# Altium schematic sheet I2C_CH1.SchDoc
size A3; ApprovedBy: D. Grossman; CheckedBy: G. Engel; Author: Y. Yakov; CompanyName: LightSense; DrawnBy: Y. Yakov; Engineer: Y.Yakov; Organization: LightSense
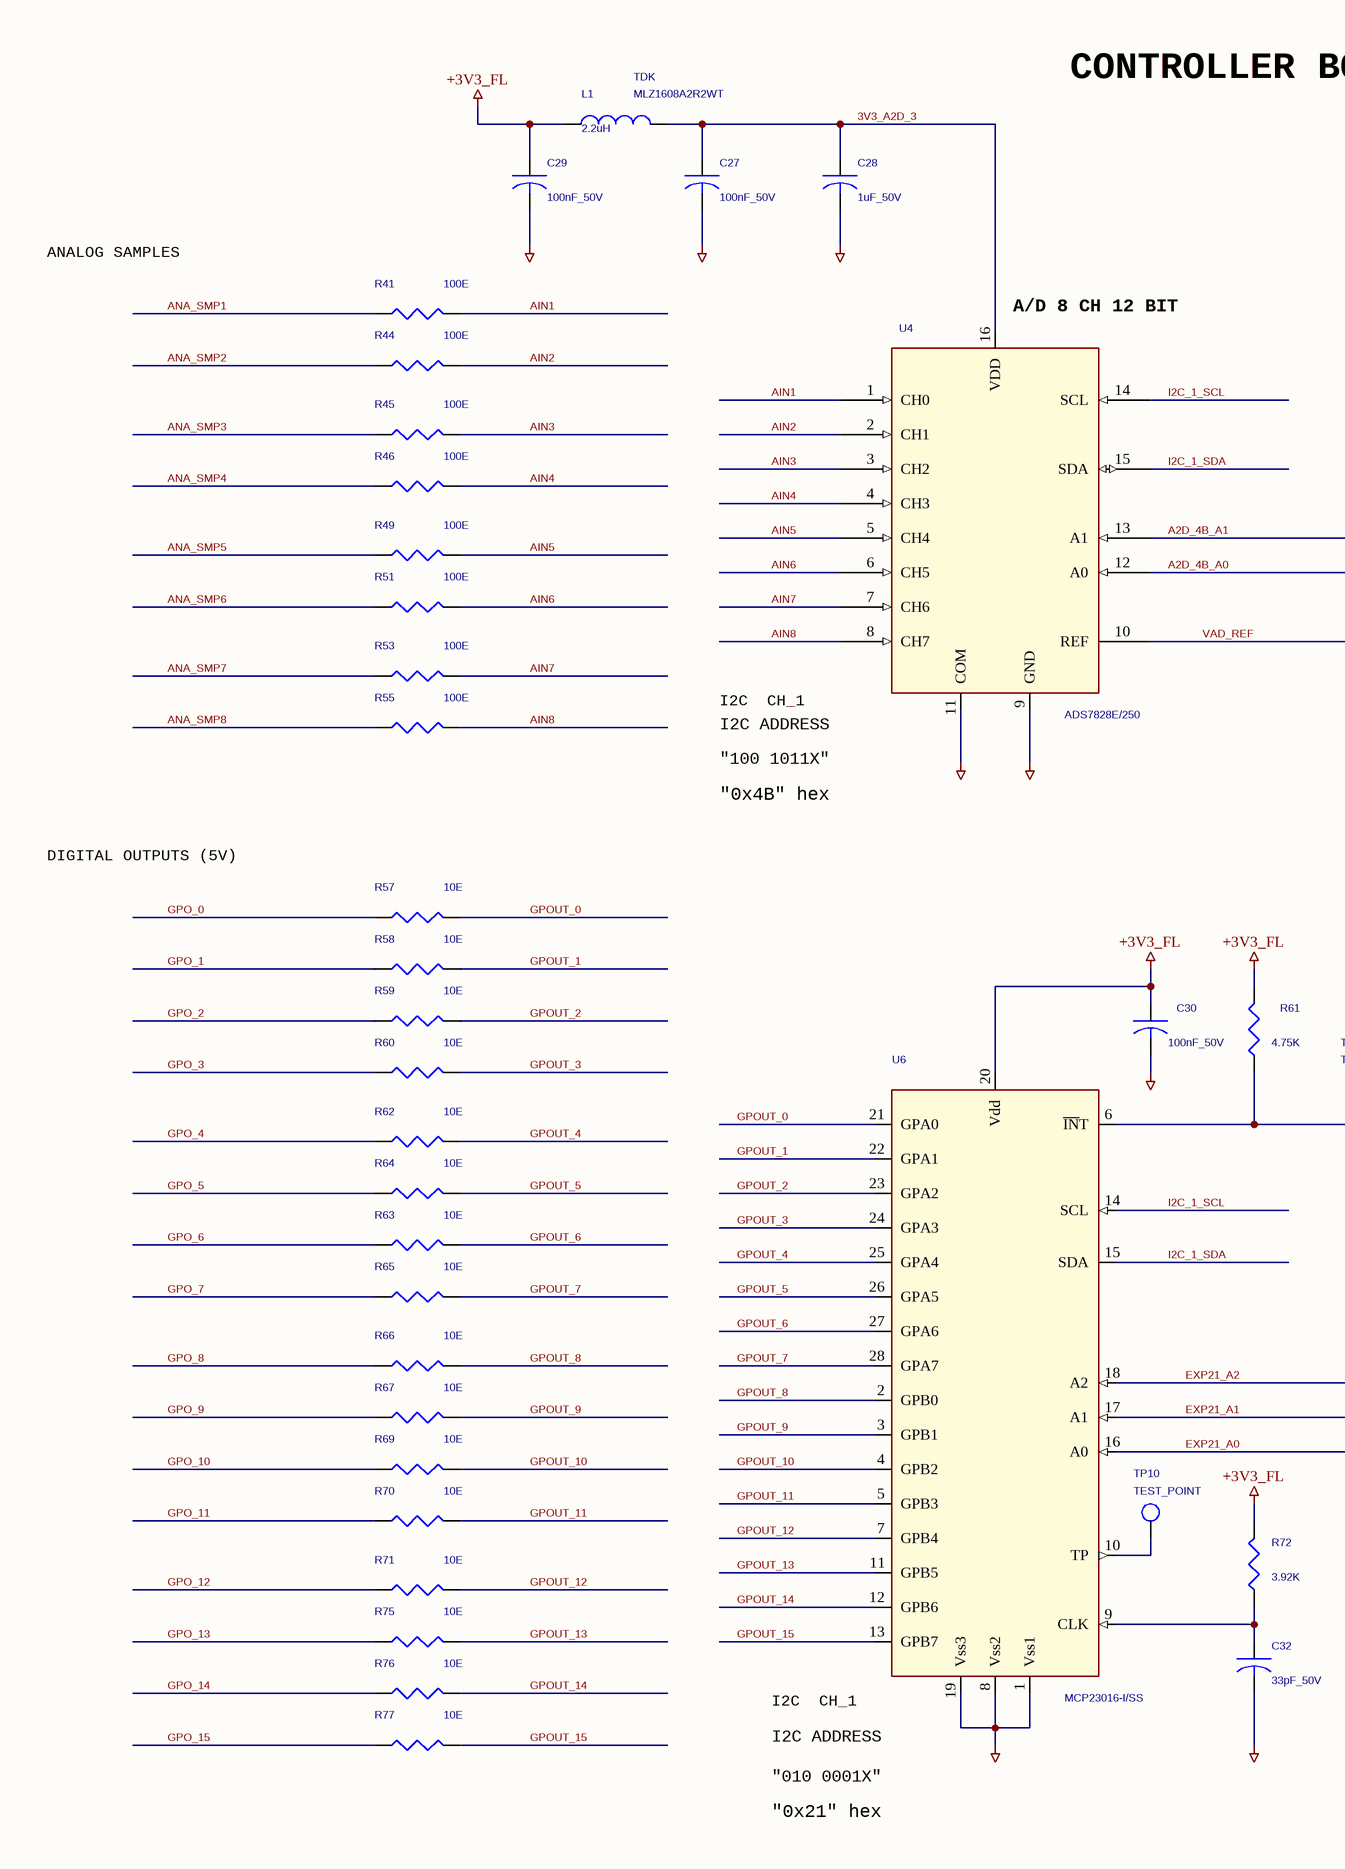
[diagram p0: I2C_CH1.SchDoc, left]
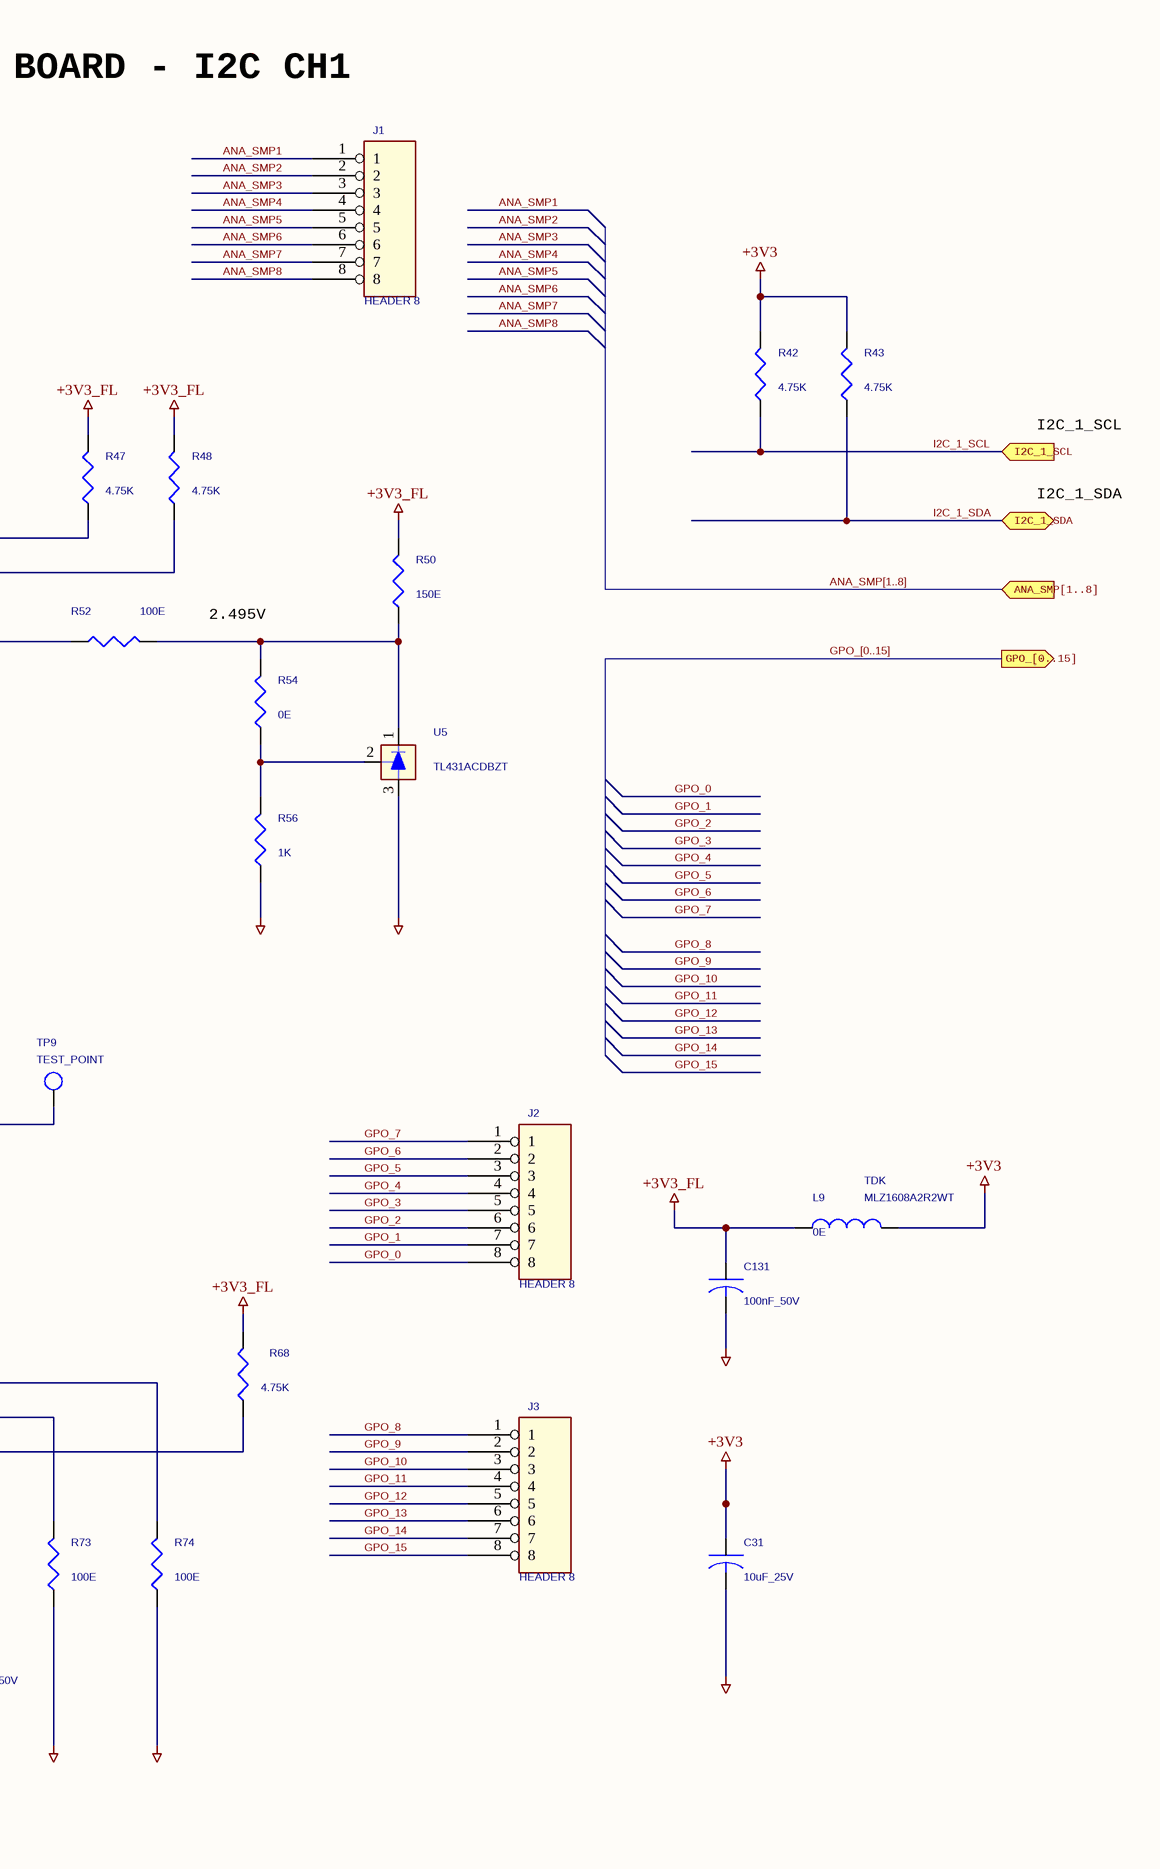
[diagram p1: I2C_CH1.SchDoc, right]

## Parts
C27  100nF_50V  [0603]
C28  1uF_50V  [0805]
C29  100nF_50V  [0603]
C30  100nF_50V  [0603]
C31  10uF_25V  [1206]
C32  33pF_50V  [0603]
C131  100nF_50V  [0603]
J1  HEADER 8  [TH_8PIN_100mil]
J2  HEADER 8  [TH_8PIN_100mil]
J3  HEADER 8  [TH_8PIN_100mil]
L1  2.2uH  MFG_PN: MLZ1608A2R2WT  MFG: TDK  [0603]
L9  0E  MFG: TDK  MFG_PN: MLZ1608A2R2WT  [0603]
R41  100E  [0603]
R42  4.75K  [0603]
R43  4.75K  [0603]
R44  100E  [0603]
R45  100E  [0603]
R46  100E  [0603]
R47  4.75K  [0603]
R48  4.75K  [0603]
R49  100E  [0603]
R50  150E  [0603]
R51  100E  [0603]
R52  100E  [0603]
R53  100E  [0603]
R54  0E  [0603]
R55  100E  [0603]
R56  1K  [0603]
R57  10E  [0603]
R58  10E  [0603]
R59  10E  [0603]
R60  10E  [0603]
R61  4.75K  [0603]
R62  10E  [0603]
R63  10E  [0603]
R64  10E  [0603]
R65  10E  [0603]
R66  10E  [0603]
R67  10E  [0603]
R68  4.75K  [0603]
R69  10E  [0603]
R70  10E  [0603]
R71  10E  [0603]
R72  3.92K  [0603]
R73  100E  [0603]
R74  100E  [0603]
R75  10E  [0603]
R76  10E  [0603]
R77  10E  [0603]
TP9  TEST_POINT  [TH_1mm]
TP10  TEST_POINT  [TH_1mm]
U4  ADS7828E/250  [TSSOP_16]
U5  TL431ACDBZT  [SOT_23]
U6  MCP23016-I/SS  [SSOP_28]

## Ports
ANA_SMP[1..8] (in), GPO_[0..15] (out), I2C_1_SCL (in), I2C_1_SDA (bidir)

## Nets
+3V3: C31.1 L9.2 R42.2 R43.2
+3V3_FL: C29.1 C30.1 C131.1 L1.1 L9.1 R47.2 R48.2 R50.2 R61.2 R68.2 R72.2 U6.20(Vdd)
GND_CPU: C27.2 C28.2 C29.2 C30.2 C31.2 C32.2 C131.2 R56.1 R73.1 R74.1 U4.9(GND) U4.11(COM) U5.3(ANODA) U6.1(Vss1) U6.8(Vss2) U6.19(Vss3)
3V3_A2D_3: C27.1 C28.1 L1.2 U4.16(VDD)
A2D_4B_A0: R48.1 U4.12(A0)
A2D_4B_A1: R47.1 U4.13(A1)
AIN1: R41.1 U4.1(CH0)
AIN2: R44.1 U4.2(CH1)
AIN3: R45.1 U4.3(CH2)
AIN4: R46.1 U4.4(CH3)
AIN5: R49.1 U4.5(CH4)
AIN6: R51.1 U4.6(CH5)
AIN7: R53.1 U4.7(CH6)
AIN8: R55.1 U4.8(CH7)
ANA_SMP1: J1.1 R41.2
ANA_SMP2: J1.2 R44.2
ANA_SMP3: J1.3 R45.2
ANA_SMP4: J1.4 R46.2
ANA_SMP5: J1.5 R49.2
ANA_SMP6: J1.6 R51.2
ANA_SMP7: J1.7 R53.2
ANA_SMP8: J1.8 R55.2
EXP21_A0: R68.1 U6.16(A0)
EXP21_A1: R73.2 U6.17(A1)
EXP21_A2: R74.2 U6.18(A2)
GPO_0: J2.8 R57.2
GPO_1: J2.7 R58.2
GPO_2: J2.6 R59.2
GPO_3: J2.5 R60.2
GPO_4: J2.4 R62.2
GPO_5: J2.3 R64.2
GPO_6: J2.2 R63.2
GPO_7: J2.1 R65.2
GPO_8: J3.1 R66.2
GPO_9: J3.2 R67.2
GPO_10: J3.3 R69.2
GPO_11: J3.4 R70.2
GPO_12: J3.5 R71.2
GPO_13: J3.6 R75.2
GPO_14: J3.7 R76.2
GPO_15: J3.8 R77.2
GPOUT_0: R57.1 U6.21(GPA0)
GPOUT_1: R58.1 U6.22(GPA1)
GPOUT_2: R59.1 U6.23(GPA2)
GPOUT_3: R60.1 U6.24(GPA3)
GPOUT_4: R62.1 U6.25(GPA4)
GPOUT_5: R64.1 U6.26(GPA5)
GPOUT_6: R63.1 U6.27(GPA6)
GPOUT_7: R65.1 U6.28(GPA7)
GPOUT_8: R66.1 U6.2(GPB0)
GPOUT_9: R67.1 U6.3(GPB1)
GPOUT_10: R69.1 U6.4(GPB2)
GPOUT_11: R70.1 U6.5(GPB3)
GPOUT_12: R71.1 U6.7(GPB4)
GPOUT_13: R75.1 U6.11(GPB5)
GPOUT_14: R76.1 U6.12(GPB6)
GPOUT_15: R77.1 U6.13(GPB7)
I2C_1_SCL: R42.1 U4.14(SCL) U6.14(SCL) ; port I2C_1_SCL
I2C_1_SDA: R43.1 U4.15(SDA) U6.15(SDA) ; port I2C_1_SDA
VAD_REF: R52.2 U4.10(REF)
NetC32_1: C32.1 R72.1 U6.9(CLK)
NetR50_1: R50.1 R52.1 R54.2 U5.1(CAT)
NetR54_1: R54.1 R56.2 U5.2(Vref)
NetR61_1: R61.1 TP9.1(TP) U6.6(~{IN}T)
NetTP10_1: TP10.1(TP) U6.10(TP)

## Buses and harness runs
bus ANA_SMP[1..8] = port ANA_SMP[1..8]
bus GPO_[0..15] = port GPO_[0..15]

## Notes on the sheet
- CONTROLLER BOARD - I2C CH1
- ANALOG SAMPLES
- (near U4) A/D 8 CH 12 BIT
- I2C_1_SCL
- I2C_1_SDA
- 2.495V
- I2C ADDRESS
- I2C  CH_1
- "0x4B" hex
- "100 1011X"
- DIGITAL OUTPUTS (5V)
- (near U6) I2C ADDRESS
- (near U6) I2C  CH_1
- "0x21" hex
- "010 0001X"
- Name
- Signature
- Date
- File:
- Board Name:
- Description:
- Document Version:
- Sheet
- of
- Approved
- Reviewed
- Designed
- This drawing and any accompanying documents contain confidential information intended for a specific individual and purpose.
  This information, owned by Lightsense, is private and confidential. If you are not the intended recipient, you are hereby notified that any disclosure, copying or distribution, or the taking of any action based on the contents of this information, is strictly prohibited.

## Library data of the parts
C27 = C: CAP_SMT_0603_50V_X7R_10%; MFG_PN: C0603C104K5RAC; MFG: KEMET
C28 = CAP: a; Mnfctr_Part_Number: TCJT106M016R0150; MFG: Murata; MFG_PN: GRM21BR60J106K
C29 C131 = C: CAP_SMT_0603_50V_X7R_10%; MFG: KEMET; MFG_PN: C0603C104K5RAC
C30 = C: CAP_SMT_0603_50V_X7R_10%; MFG: KEMET; Lumenis_P/N: EC1691600; MFG_PN: C0603C104K5RAC
C31 = C: CAP_SMT_1206_25V_X7R_10%; MFG_PN: C1206C106K3RAC; MFG: KEMET
C32 = C: CAP_SMT_0603_50V_X7R_10%; MFG_PN: C0603C330K5RAC; MFG: KEMET
L1 L9 = INDUCTOR
R41 R44-R46 R49 R51-R53 R55 R73 R74 = R_Dup1: MFG: YAGEO; MFG_PN: RC0603FR-07100RL
R42 R48 R61 R68 = R_Dup1: MFG: YAGEO; MFG_PN: RC0603FR-074K75L
R43 R47 = R_Dup1: MFG_PN: RC0603FR-074K75L; MFG: YAGEO
R50 = R_Dup1: MFG_PN: RC0603FR-07150RL; MFG: YAGEO
R54 = R_Dup1: MFG: YAGEO; MFG_PN: RC0603FR-070R00L
R56 = R_Dup1: MFG: YAGEO; MFG_PN: RC0603FR-071K00L
R57 R58 R62 R64 = R_Dup1: MFG_PN: RC0603FR-0710R0L; MFG: YAGEO
R59 R60 R63 R65-R67 R69-R71 R75-R77 = R_Dup1: MFG: YAGEO; MFG_PN: RC0603FR-0710R0L
R72 = R_Dup1: MFG_PN: RC0603FR-073K92L; MFG: YAGEO
TP9 TP10 = T POINT R_Dup1
U4 = ADS7828E: MFG: TI; MFG_PN: ADS7828E/250
U5 = TL431ACDBZT: Part_Number: <Part_Number>; MFG: TI; MFG_PN: TL431ACDBZT
U6 = MCP23016-I/SS: MFG: MICROCHIP; MFG_PN: MCP23016-I/SS